# EAGLE schematic JSDM Wemos DS3231 Single Layer (EAGLE 7.7.0)
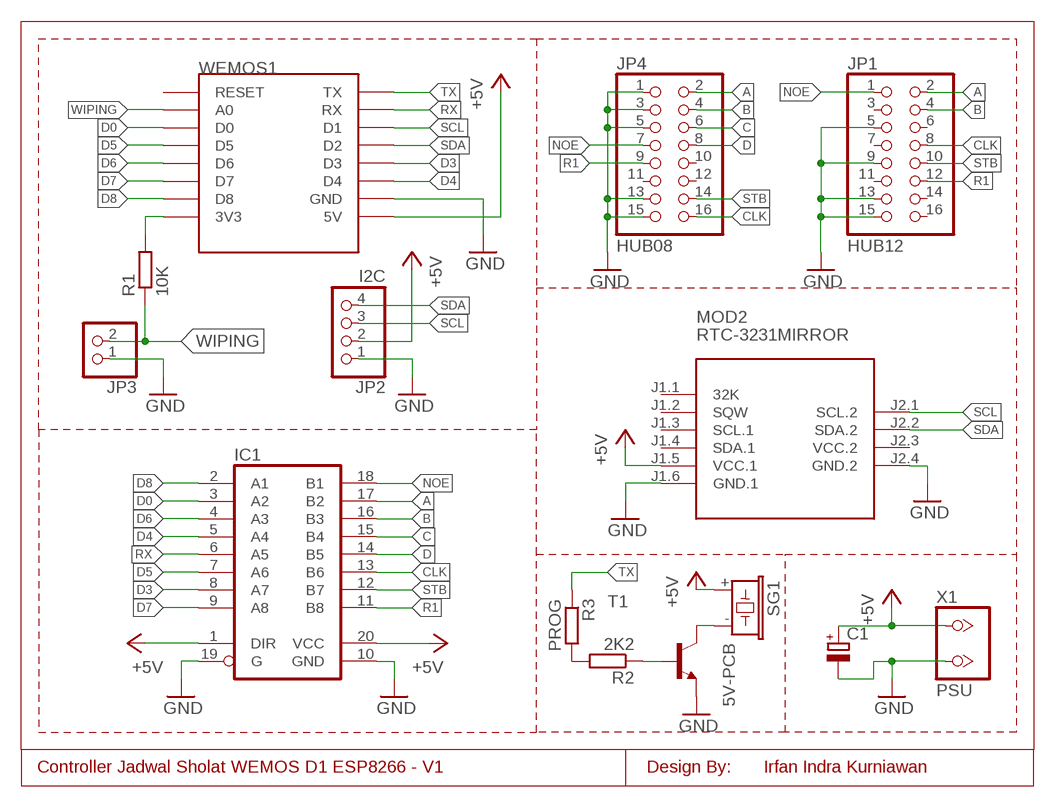
[diagram p0: schematic, sheet 1]

## Parts
C1  CPOL-EUE3.5-8  [E3,5-8]
IC1  74245SMD  [SO20]
JP1  HUB12  PINHD-2X8  [2X08]
JP2  I2C  PINHD-1X4  [1X04]
JP3  PINHD-1X2  [1X02]
JP4  HUB08  PINHD-2X8  [2X08]
MOD2  RTC-3231MIRROR  [RTC-DS3231-MIRROR]
R1  10K  R-EU_0207/12  [0207/12]
R2  2K2  R-EU_0207/7  [0207/7]
R3  PROG  R-EU_M0805  [M0805]
SG1  5V-PCB  [5V]
T1  BC317-NPN-TO92-EBC  [TO92-EBC]
WEMOS1  WEMOS-D1-MINI  [WEMOS-D1-MINI]
X1  PSU  2PIN  [TB2]

## Nets
+5V: C1.+ IC1.1(DIR) IC1.20(VCC) JP2.2 MOD2.J1.5(VCC.1) SG1.+ WEMOS1.5V X1.1
A: IC1.17(B2) JP1.2 JP4.2
B: IC1.16(B3) JP1.4 JP4.4
C: IC1.15(B4) JP4.6
CLK: IC1.13(B6) JP1.8 JP4.16
D: IC1.14(B5) JP4.8
D0: IC1.3(A2) WEMOS1.D0
D3: IC1.8(A7) WEMOS1.D3
D4: IC1.5(A4) WEMOS1.D4
D5: IC1.7(A6) WEMOS1.D5
D6: IC1.4(A3) WEMOS1.D6
D7: IC1.9(A8) WEMOS1.D7
D8: IC1.2(A1) WEMOS1.D8
GND: C1.- IC1.10(GND) IC1.19(G) JP1.5 JP1.9 JP1.13 JP1.15 JP2.1 JP3.1 JP4.1 JP4.3 JP4.5 JP4.13 JP4.15 MOD2.J1.6(GND.1) MOD2.J2.4(GND.2) T1.E WEMOS1.GND X1.2
N$1: R1.2 WEMOS1.3V3
N$2: SG1.- T1.C
N$3: R2.1 T1.B
N$6: R2.2 R3.2
NOE: IC1.18(B1) JP1.1 JP4.7
R1: IC1.11(B8) JP1.12 JP4.9
RX: IC1.6(A5) WEMOS1.RX
SCL: JP2.3 MOD2.J2.1(SCL.2) WEMOS1.D1
SDA: JP2.4 MOD2.J2.2(SDA.2) WEMOS1.D2
STB: IC1.12(B7) JP1.10 JP4.14
TX: R3.1 WEMOS1.TX
WIPING: JP3.2 R1.1 WEMOS1.A0
Unconnected: JP1.3 JP1.6 JP1.7 JP1.11 JP1.14 JP1.16 JP4.10 JP4.11 JP4.12 MOD2.J1.1(32K) MOD2.J1.2(SQW) MOD2.J1.3(SCL.1) MOD2.J1.4(SDA.1) WEMOS1.RESET

## Notes on the sheet
- Controller Jadwal Sholat WEMOS D1 ESP8266 - V1 | Design By: | Irfan Indra Kurniawan

## Power pins joined to a net without a drawn wire
VCC.2: MOD2.J2.3(VCC.2)

## Library data of the parts
C1 = FansElectronics-RCL:CPOL-EU: POLARIZED CAPACITOR, European symbol
IC1 = FansElectronics-IC-74xx:74*245
JP1 JP4 = FansElectronics-Header:PINHD-2X8: PIN HEADER
JP2 = FansElectronics-Header:PINHD-1X4: PIN HEADER
JP3 = FansElectronics-Header:PINHD-1X2: PIN HEADER
MOD2 = FansElectronics-Modul:RTC-3231
R1-R3 = FansElectronics-RCL:R-EU_: RESISTOR, European symbol
SG1 = FansElectronics-Buzzer:5V-PCB: Buzzer 5V on PCB
T1 = transistor:*-NPN-: NPN Transistror BF959 corrected 2008.03.06
WEMOS1 = esp8266modules:WEMOS-D1-MINI: WeMos.cc D1 mini ESP8266 module
X1 = FansElectronics-Con-Screw:2PIN